# Altium schematic sheet 2.interface.SchDoc: 接口
size A4; DrawnBy: 蒋朝晖; Organization: Seneasy; DocumentNumber: 项目编号; Revision: 版本号; SheetNumber: 1; SheetTotal: 2; PageSetup: Record=PageOptions|CenterHorizontal=True|CenterVertical=True|PrintScale=0.98|XCorrection=1.00|YCorrection=1.00|PrintKind=1|BorderSize=5000000|LeftOffset=0|BottomOffset=0|Orientation=2|PaperLength=2970|PaperWidth=2100|Scale=100|PaperSource=261|PrintQuality=-3|MediaType=1|DitherType=10|PrintScaleMode=1|PaperKind=A4 210 x 297 毫米¦PaperIndex=9; Time: 2018-10-21
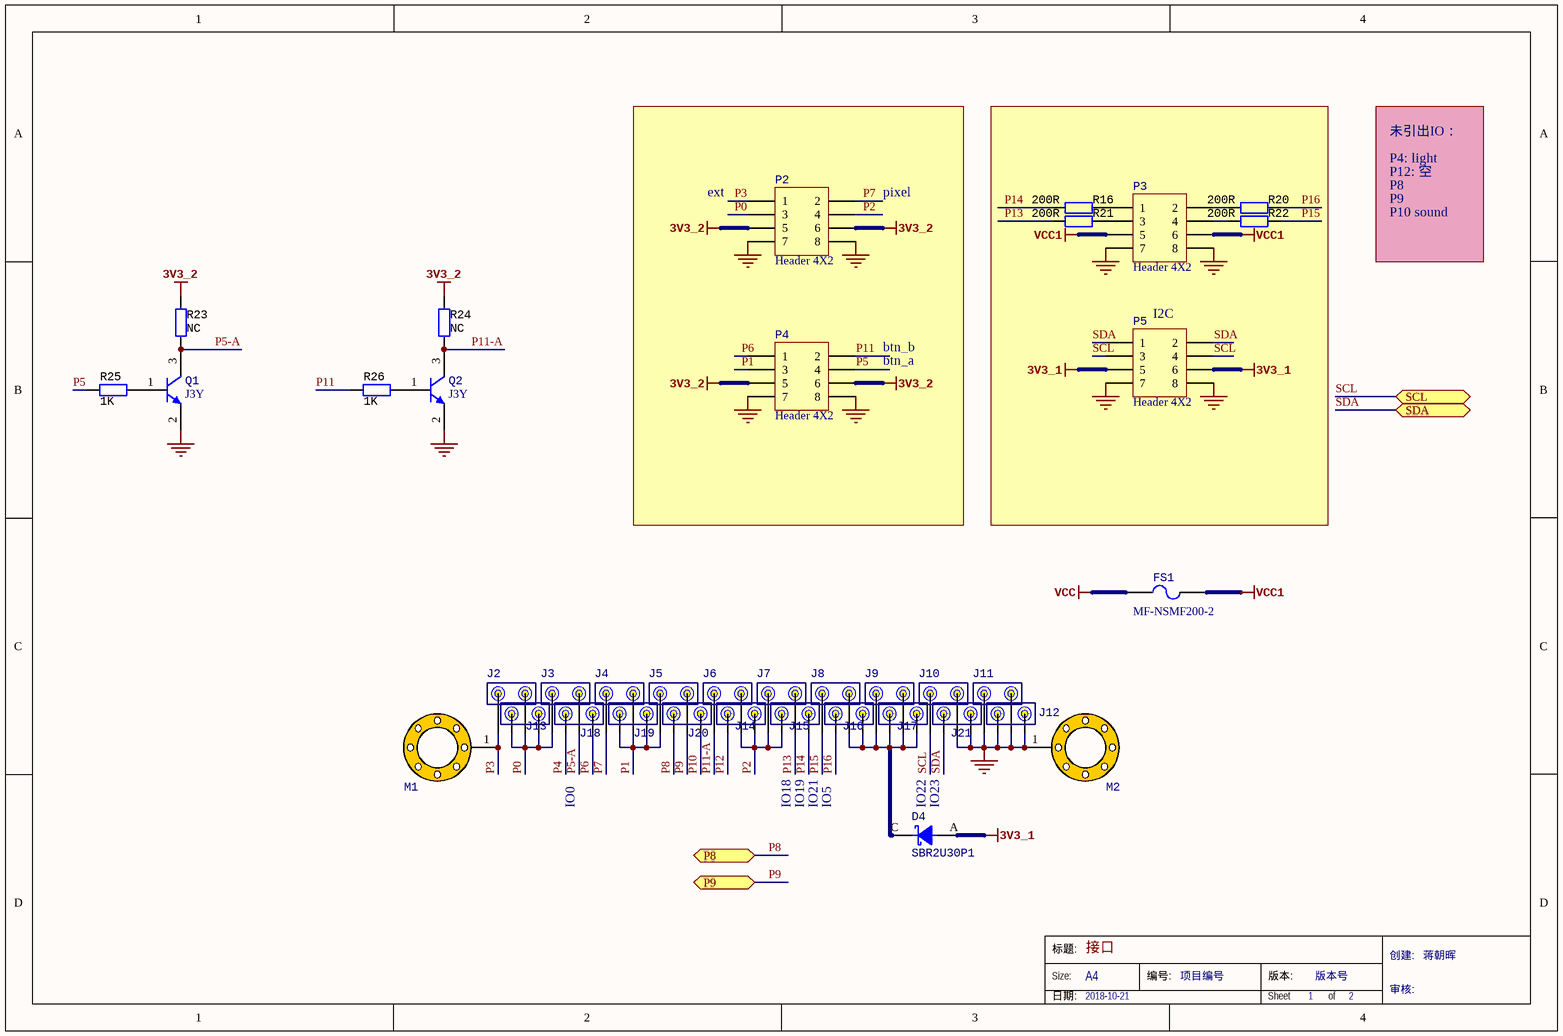
[diagram p0: 2.interface.SchDoc]

## Parts
D4  SBR2U30P1  [POWERDI123]
FS1  MF-NSMF200-2  [R1206]
J2  (no value)  [顶针座子（2.54MM）]
J3  (no value)  [顶针座子（2.54MM）]
J4  (no value)  [顶针座子（2.54MM）]
J5  (no value)  [顶针座子（2.54MM）]
J6  (no value)  [顶针座子（2.54MM）]
J7  (no value)  [顶针座子（2.54MM）]
J8  (no value)  [顶针座子（2.54MM）]
J9  (no value)  [顶针座子（2.54MM）]
J10  (no value)  [顶针座子（2.54MM）]
J11  (no value)  [顶针座子（2.54MM）]
J12  (no value)  [顶针座子（2.54MM）]
J13  (no value)  [顶针座子（2.54MM）]
J14  (no value)  [顶针座子（2.54MM）]
J15  (no value)  [顶针座子（2.54MM）]
J16  (no value)  [顶针座子（2.54MM）]
J17  (no value)  [顶针座子（2.54MM）]
J18  (no value)  [顶针座子（2.54MM）]
J19  (no value)  [顶针座子（2.54MM）]
J20  (no value)  [顶针座子（2.54MM）]
J21  (no value)  [顶针座子（2.54MM）]
M1  (no value)  [3MM螺丝孔]
M2  (no value)  [3MM螺丝孔]
P2  Header 4X2  [HDR2X4]
P3  Header 4X2  [HDR2X4]
P4  Header 4X2  [HDR2X4]
P5  Header 4X2  [HDR2X4]
Q1  J3Y  [DFN 3L]
Q2  J3Y  [DFN 3L]
R16  200R  [0402]
R20  200R  [0402]
R21  200R  [0402]
R22  200R  [0402]
R23  NC  [0402]
R24  NC  [0402]
R25  1K  [0402]
R26  1K  [0402]

## Blocks framed on the sheet
I2C: P3 P5 R16 R20-R22

## Ports
P8 (bidir), P9 (bidir), SCL (bidir), SDA (bidir)

## Nets
3V3_1: D4.A(ANODE) P5.5 P5.6
3V3_2: P2.5 P2.6 P4.5 P4.6 R23.1 R24.1
NetJ10_2: J10.2 J11.1 J11.2 J12.1 J12.2 J21.2 M2.1 P2.7 P2.8 P3.7 P3.8 P4.7 P4.8 P5.7 P5.8 Q1.2(E) Q2.2(E)
VCC: FS1.2
VCC1: FS1.1 P3.5 P3.6
P0: J2.2 J3.1 J13.1 J13.2 P2.3
P1: J4.2 J5.1 J19.1 J19.2 P4.3
P2: J6.2 J7.1 J14.2 J15.1 P2.4
P3: J2.1 M1.1 P2.1
P4: J18.1
P5: P4.4 R25.1
P5-A: J3.2 Q1.3(C) R23.2
P6: J18.2 P4.1
P7: J4.1 P2.2
P8: J20.1 ; port P8
P9: J5.2 ; port P9
P10: J20.2
P11: P4.2 R26.1
P11-A: J6.1 Q2.3(C) R24.2
P12: J14.1
P13: J7.2 R21.1
P14: J15.2 R16.1
P15: J8.1 R22.2
P16: J16.1 R20.2
SCL: J10.1 P5.3 P5.4 ; port SCL
SDA: J21.1 P5.1 P5.2 ; port SDA
NetD4_C: D4.C(CATHODE) J8.2 J9.1 J9.2 J16.2 J17.1 J17.2
NetP3_1: P3.1 R16.2
NetP3_2: P3.2 R20.1
NetP3_3: P3.3 R21.2
NetP3_4: P3.4 R22.1
NetQ1_1: Q1.1(B) R25.2
NetQ2_1: Q2.1(B) R26.2

## Notes on the sheet
- 未引出IO：
- P4: light
- P12: 空
- (near P2) ext
- pixel
- P8
- P9
- P10 sound
- btn_a
- btn_b
- IO0
- IO18
- IO19
- IO21
- IO5
- (near D4) IO22
- (near D4) IO23
- 标题:
- Size:
- A4
- 编号:
- 版本:
- 创建:
- 日期:
- Sheet
- of
- 审核:

## Library data of the parts
D4 = Diode_Schottky: Published: 8-Jun-2000; LatestRevisionDate: 17-Jul-2002; LatestRevisionNote: Re-released for DXP Platform.; PackageReference: SMB; Publisher: Altium Limited; PackageDescription: DO-214-AA/SMB; 2 C-Bend Leads; Body 5.3 x 3.6 mm, inc. leads (LxW); Code_JEDEC: DO-214-AA; Value: ?; PartNumber: ?; Manufacturer: ?
FS1 = 电子保险丝: 保险管
J2-J11 = pogopin
J12-J21 = pogopin_32
M1 M2 = screw
P2-P5 = Header 4X2: Header, 4-Pin, Dual row; LatestRevisionDate: 17-Jul-2002; LatestRevisionNote: Re-released for DXP Platform.; Publisher: Altium Limited
Q1 Q2 = 2N3904: NPN General Purpose Amplifier; Published: 8-Jun-2000; LatestRevisionDate: 15-Jan-2003; LatestRevisionNote: PCB Footprint 'BCY-W3/D4.7' replaced; DatasheetVersion: 1997; PackageVersion: Sep-1998; PackageReference: TO-92A; Publisher: Altium Limited; PackageDescription: TO, Flat Index; 3 In-Line, Axial Leads; Body Dia. 4.5mm; Leads 0.51 x 0.48 mm (max); ComponentLink1Description: Manufacturer Link; ComponentLink1URL: http://www.fairchildsemi.com/; ComponentLink2Description: Datasheet; ComponentLink2URL: http://www.fairchildsemi.com/ds/2N%2F2N3904.pdf
R16 R20-R22 R25 R26 = RES1: RES, 1.0k ohm, 5%, 0.1W, 0603; PartNumber: RC0603JR-071KL; Manufacturer: Yageo America; CompType: Resistor; Res_ohm: 1000; Value_Code: 1k00; Tolerance_%: 5; Power_W: 0.1; VDC_V: 50; TempCo: 100 ppm/C; EIA_Code: E24; U/M: EA; SymbolVersion: 2009-05-29; RoHS: Y; Value1: 5%; Value2: 0.1W; MountType: SMT; Technology: Thick Film; Published: 2008-06-26; Publisher: Texas Instruments; LatestRevisionDate: 2014-04-18; ComponentLink1Description: Datasheet link; ComponentLink1URL: http://www.yageo.com/pdf/Pu-RC0603_51_PbFree_L_2.pdf; Supplier Part Number 1: 311-1.0KGRCT-ND; Supplier 2: Mouser; Supplier Part Number 2: 603-RC0603JR-071KL; Supplier 3: Farnell; Supplier Part Number 3: 9233385; PackageReference: 0603
  R16 R20-R22: Value: 200R
  R25 R26: Value: 1K
R23 R24 = RES1: RES, 1.0k ohm, 5%, 0.1W, 0603; PartNumber: RC0603JR-071KL; Manufacturer: Yageo America; CompType: Resistor; Res_ohm: 1000; Value_Code: 1k00; Tolerance_%: 5; Power_W: 0.1; VDC_V: 50; TempCo: 100 ppm/C; EIA_Code: E24; U/M: EA; Value: 10K; SymbolVersion: 2009-05-29; RoHS: Y; Value1: 5%; Value2: 0.1W; MountType: SMT; Technology: Thick Film; Published: 2008-06-26; Publisher: Texas Instruments; LatestRevisionDate: 2014-04-18; ComponentLink1Description: Datasheet link; ComponentLink1URL: http://www.yageo.com/pdf/Pu-RC0603_51_PbFree_L_2.pdf; Supplier Part Number 1: 311-1.0KGRCT-ND; Supplier 2: Mouser; Supplier Part Number 2: 603-RC0603JR-071KL; Supplier 3: Farnell; Supplier Part Number 3: 9233385; PackageReference: 0603